# Altium schematic sheet BOOST.SchDoc
size A3
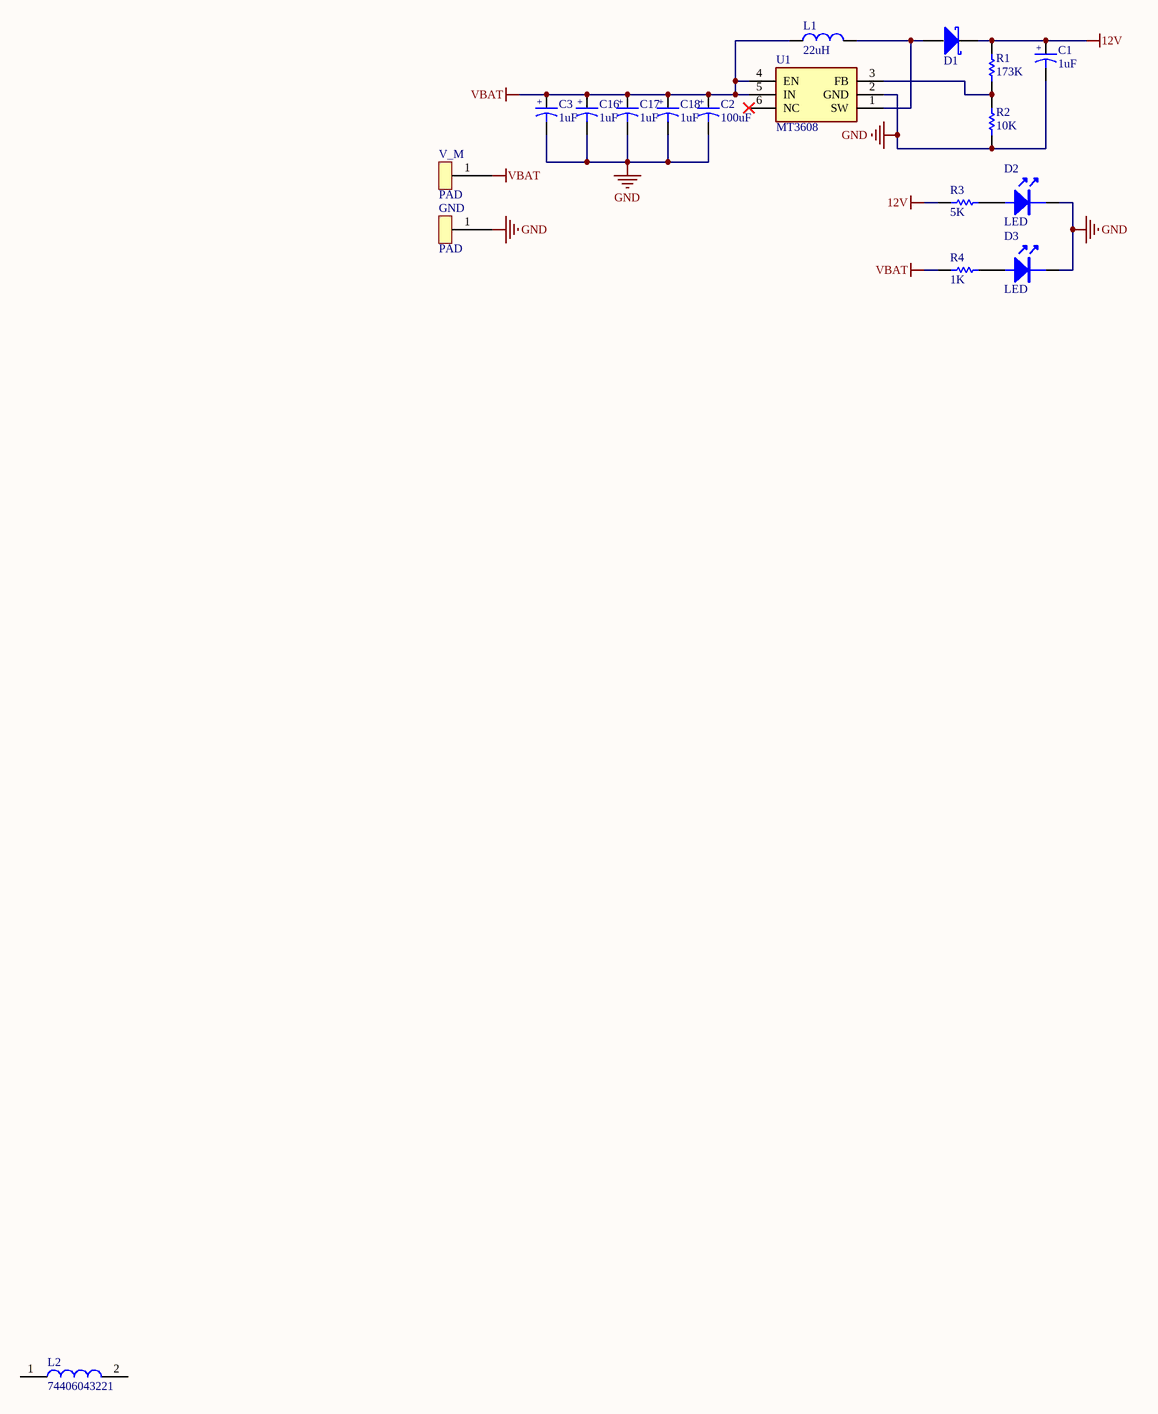
[diagram p0: BOOST.SchDoc]

## Parts
C1  1uF  [C5X5]
C2  100uF  [C10X10]
C3  1uF  [C5X5]
C16  1uF  [C5X5]
C17  1uF  [C5X5]
C18  1uF  [C5X5]
D1  Diode Schottky  [DO-214AC]  (value not drawn)
D2  LED  [0603_LED]
D3  LED  [0603_LED]
GND  PAD  [PAD]
L1  22uH  [L 5x5]
L2  74406043221  [INDPM4848X280N]
R1  173K  [0603_R]
R2  10K  [0603_R]
R3  5K  [0603_R]
R4  1K  [0603_R]
U1  MT3608  [SOT95P280X145-6N]
V_M  PAD  [PAD]

## Nets
12V: C1.1 D1.2(K) R1.2 R3.2
GND: C1.2 C2.2 C3.2 C16.2 C17.2 C18.2 D2.2(K) D3.2(K) GND.1 R2.1 U1.2(GND)
VBAT: C2.1 C3.1 C16.1 C17.1 C18.1 L1.1 R4.2 U1.4(EN) U1.5(IN) V_M.1
NetD1_1: D1.1(A) L1.2 U1.1(SW)
NetD2_1: D2.1(A) R3.1
NetD3_1: D3.1(A) R4.1
NetR1_1: R1.1 R2.2 U1.3(FB)

Not connected (* = marked no-connect by the designer): L2 1 2; U1 6(NC)*

## Notes on the sheet
- (in symbol CAP1) +
- (in symbol Cap_polar) +

## Library data of the parts
C1 C3 C16-C18 = CAP1
C2 = Cap_polar
D2 D3 = LED: LED 发光二极管
L1 = L_Inductance
L2 = 74406043221: Inductor; Manufacturer_Name: Wurth Elektronik; Datasheet Link: https://componentsearchengine.com/Datasheets/2/74406043221.pdf; Height: 2.8mm; Manufacturer_Part_Number: 74406043221; Mouser Part Number: 710-74406043221; Mouser Price/Stock: https://www.mouser.com/Search/Refine.aspx?Keyword=710-74406043221; RS Part Number: 1354936; RS Price/Stock: https://uk.rs-online.com/web/p/products/1354936
R1-R3 = RES: Resistor; Value: 1K; Published: 8-Jun-2000; Revision: July-2002: Re-released for DXP Platform.; Publisher: Altium Limited
R4 = RES: Resistor; Published: 8-Jun-2000; Revision: July-2002: Re-released for DXP Platform.; Publisher: Altium Limited; Value: 1K
U1 = MT3608: Undefined or Miscellaneous; Manufacturer_Name: Aerosemi; Datasheet Link: https://www.olimex.com/Products/Breadboarding/BB-PWR-3608/resources/MT3608.pdf; Height: 1.45mm; Manufacturer_Part_Number: MT3608